# Altium schematic sheet schChaves.SchDoc
size A4
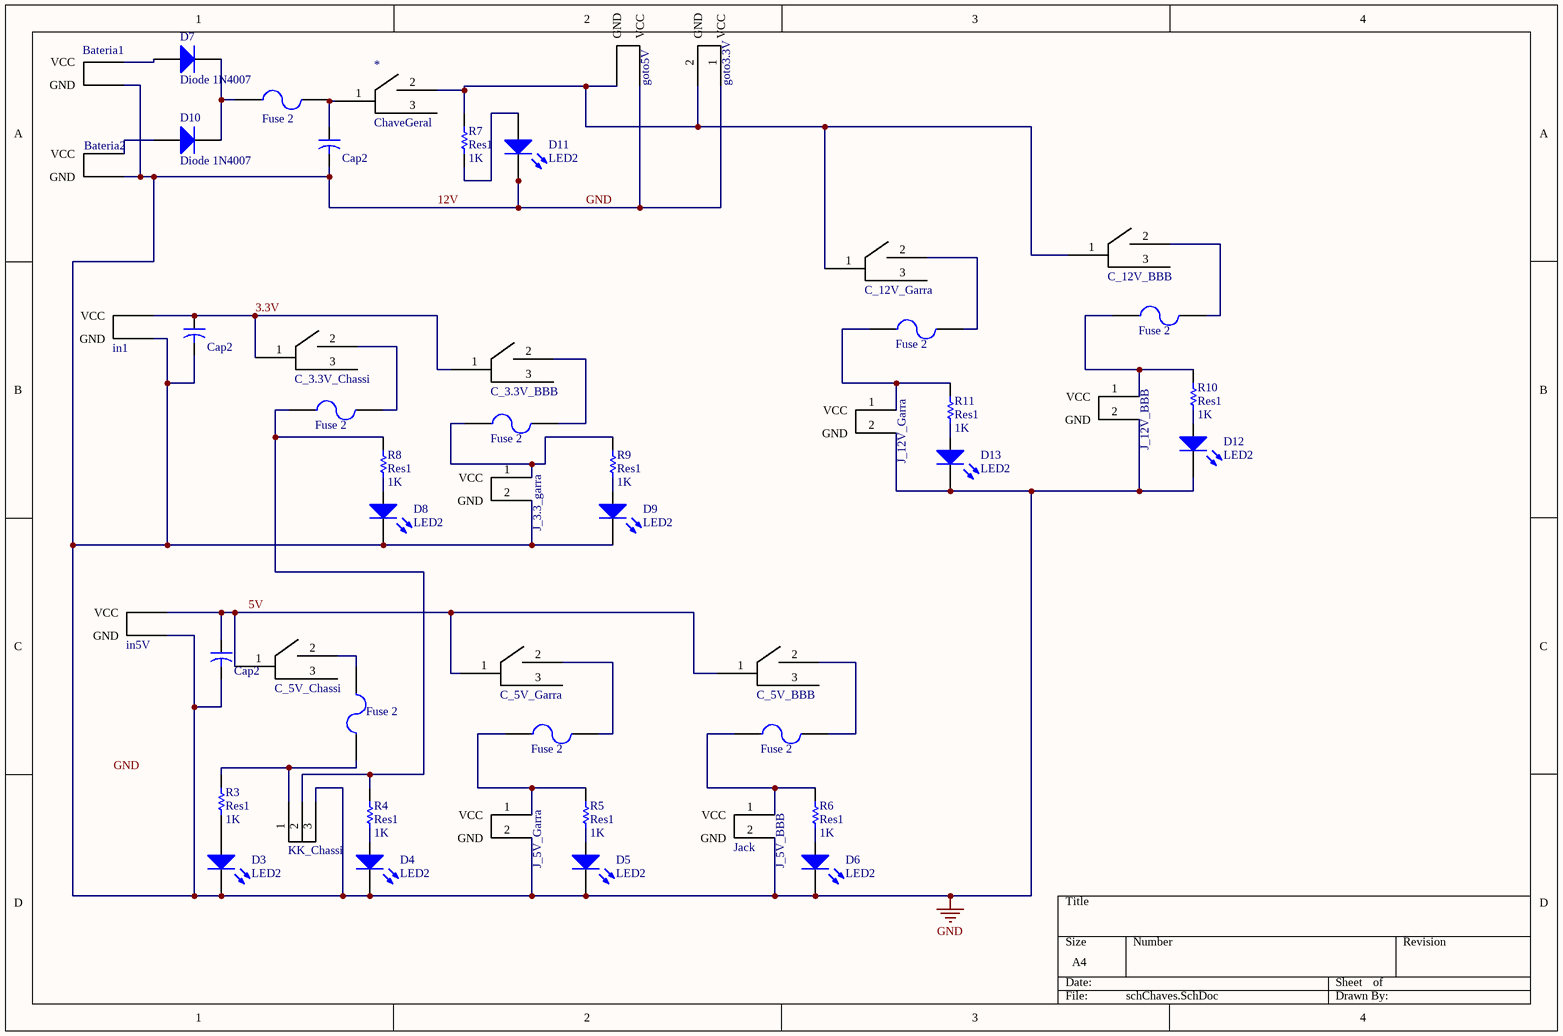
[diagram p0: schChaves.SchDoc]

## Parts
*  ChaveGeral  [Chave]
Bateria1  Jack  [JACK J4]  (value not drawn)
Bateria2  Jack  [JACK J4]  (value not drawn)
C_3.3V_BBB  Chave  [Chave]  (value not drawn)
C_3.3V_Chassi  Chave  [Chave]  (value not drawn)
C_5V_BBB  Chave  [Chave]  (value not drawn)
C_5V_Chassi  Chave  [Chave]  (value not drawn)
C_5V_Garra  Chave  [Chave]  (value not drawn)
C_12V_BBB  Chave  [Chave]  (value not drawn)
C_12V_Garra  Chave  [Chave]  (value not drawn)
C_parrudo  Cap2  [CAPR5-4X5]
C_parrudo1  Cap2  [CAPR5-4X5]
C_parrudo2  Cap2  [CAPR5-4X5]
D3  LED2  [2-vias]
D4  LED2  [2-vias]
D5  LED2  [2-vias]
D6  LED2  [2-vias]
D7  Diode 1N4007  [DO-41]
D8  LED2  [2-vias]
D9  LED2  [2-vias]
D10  Diode 1N4007  [DO-41]
D11  LED2  [2-vias]
D12  LED2  [2-vias]
D13  LED2  [2-vias]
F1  Fuse 2  [AXIAL-0.9]
F2  Fuse 2  [AXIAL-0.9]
F3  Fuse 2  [AXIAL-0.9]
F4  Fuse 2  [AXIAL-0.9]
F5  Fuse 2  [AXIAL-0.9]
F6  Fuse 2  [AXIAL-0.9]
F7  Fuse 2  [AXIAL-0.9]
F8  Fuse 2  [AXIAL-0.9]
goto3.3V  Jack  [JACK J4]  (value not drawn)
goto5V  Jack  [JACK J4]  (value not drawn)
in1  Jack  [JACK J4]  (value not drawn)
in5V  Jack  [JACK J4]  (value not drawn)
J_3.3_garra  Jack  [JACK J4]  (value not drawn)
J_5V_BBB  Jack  [JACK J4]
J_5V_Garra  Jack  [JACK J4]  (value not drawn)
J_12V_BBB  Jack  [JACK J4]  (value not drawn)
J_12V_Garra  Jack  [JACK J4]  (value not drawn)
KK_Chassi  KK3  [3-vias]  (value not drawn)
R3  Res1  value 1K  [AXIAL-0.3]
R4  Res1  value 1K  [AXIAL-0.3]
R5  Res1  value 1K  [AXIAL-0.3]
R6  Res1  value 1K  [AXIAL-0.3]
R7  Res1  value 1K  [AXIAL-0.3]
R8  Res1  value 1K  [AXIAL-0.3]
R9  Res1  value 1K  [AXIAL-0.3]
R10  Res1  value 1K  [AXIAL-0.3]
R11  Res1  value 1K  [AXIAL-0.3]

## Nets
12V: Bateria1.2(GND) Bateria2.2(GND) C_parrudo.2 C_parrudo1.2 C_parrudo2.2 D3.2(K) D4.2(K) D5.2(K) D6.2(K) D8.2(K) D9.2(K) D11.2(K) D12.2(K) D13.2(K) goto3.3V.1(VCC) goto5V.1(VCC) in1.2(GND) in5V.2(GND) J_3.3_garra.2(GND) J_5V_BBB.2(GND) J_5V_Garra.2(GND) J_12V_BBB.2(GND) J_12V_Garra.2(GND) KK_Chassi.3  [also labelled GND]
3.3V: C_3.3V_BBB.1(Comum) C_3.3V_Chassi.1(Comum) C_parrudo1.1 in1.1(VCC)
5V: C_5V_BBB.1(Comum) C_5V_Chassi.1(Comum) C_5V_Garra.1(Comum) C_parrudo2.1 in5V.1(VCC)
Net*_1: *.1(Comum) C_parrudo.1 F1.2
Net*_2: *.2(N.A.) C_12V_BBB.1(Comum) C_12V_Garra.1(Comum) goto3.3V.2(GND) goto5V.2(GND) R7.2
NetBateria1_1: Bateria1.1(VCC) D7.1(A)
NetBateria2_1: Bateria2.1(VCC) D10.1(A)
NetC_3.3V_BBB_2: C_3.3V_BBB.2(N.A.) F3.2
NetC_3.3V_Chassi_2: C_3.3V_Chassi.2(N.A.) F2.2
NetC_5V_BBB_2: C_5V_BBB.2(N.A.) F6.2
NetC_5V_Chassi_2: C_5V_Chassi.2(N.A.) F4.1
NetC_5V_Garra_2: C_5V_Garra.2(N.A.) F5.2
NetC_12V_BBB_2: C_12V_BBB.2(N.A.) F7.2
NetC_12V_Garra_2: C_12V_Garra.2(N.A.) F8.2
NetD3_1: D3.1(A) R3.1
NetD4_1: D4.1(A) R4.1
NetD5_1: D5.1(A) R5.1
NetD6_1: D6.1(A) R6.1
NetD7_2: D7.2(K) D10.2(K) F1.1
NetD8_1: D8.1(A) R8.1
NetD9_1: D9.1(A) R9.1
NetD11_1: D11.1(A) R7.1
NetD12_1: D12.1(A) R10.1
NetD13_1: D13.1(A) R11.1
NetF2_1: F2.1 KK_Chassi.2 R4.2 R8.2
NetF3_1: F3.1 J_3.3_garra.1(VCC) R9.2
NetF4_2: F4.2 KK_Chassi.1 R3.2
NetF5_1: F5.1 J_5V_Garra.1(VCC) R5.2
NetF6_1: F6.1 J_5V_BBB.1(VCC) R6.2
NetF7_1: F7.1 J_12V_BBB.1(VCC) R10.2
NetF8_1: F8.1 J_12V_Garra.1(VCC) R11.2

Not connected (* = marked no-connect by the designer): * 3(N.F); C_3.3V_BBB 3(N.F); C_3.3V_Chassi 3(N.F); C_5V_BBB 3(N.F); C_5V_Chassi 3(N.F); C_5V_Garra 3(N.F); C_12V_BBB 3(N.F); C_12V_Garra 3(N.F)

## Notes on the sheet
- Labels drawn without touching a wire or pin: GND

## Library data of the parts
* = Chave
C_parrudo C_parrudo1 C_parrudo2 = Cap2: Capacitor; Value: 100pF; Published: 23-Sep-2002; PackageReference: CAPR5-4X5; Publisher: Altium Limited; PackageDescription: Capacitor; 2 Leads
D3-D6 D8 D9 D11-D13 = LED2: Typical RED, GREEN, YELLOW, AMBER GaAs LED; Published: 8-Jun-2000; LatestRevisionDate: 17-Jul-2002; LatestRevisionNote: Re-released for DXP Platform.; PackageVersion: Feb-2002; PackageReference: 3.2X1.6X1.1; Publisher: Altium Limited; PackageDescription: SM LED; 2 Flat Leads
D7 D10 = Diode 1N4007: 1 Amp General Purpose Rectifier; Published: 8-Jun-2000; LatestRevisionDate: 17-Jul-2002; LatestRevisionNote: Re-released for DXP Platform.; DatasheetVersion: 1998; PackageVersion: Aug-1999; PackageReference: DO-41; Publisher: Altium Limited; PackageDescription: Diode, Axial; Body 5.2 x 2.7 mm (LxDia. max), Lead Dia. 0.86 mm (max); Code_JEDEC: DO-204-AL; ComponentLink1Description: Manufacturer Link; ComponentLink1URL: http://www.fairchildsemi.com/; ComponentLink2Description: Datasheet; ComponentLink2URL: http://www.fairchildsemi.com/ds/1N%2F1N4001.pdf
F1-F8 = Fuse 2: Fuse; Published: 8-Jun-2000; LatestRevisionDate: 17-Jul-2002; LatestRevisionNote: Re-released for DXP Platform.; PackageReference: PIN-W2/E2.8; Publisher: Altium Limited; PackageDescription: Thru-Hole; 2 Leads
KK_Chassi = KK3Vias
R3-R11 = Res1: Resistor; Published: 8-Jun-2000; LatestRevisionDate: 17-Jul-2002; LatestRevisionNote: Re-released for DXP Platform.; PackageReference: AXIAL-0.3; Publisher: Altium Limited; PackageDescription: Axial Device, Thru-Hole; 2 Leads; 0.3 in Pin Spacing